# Altium schematic sheet DAC.SchDoc: DAC
size 420 x 297 mm; Date: March 14; CheckedBy: ThS. Bùi Quốc Bảo; DrawnBy: Nguyễn Gia Huy; Revision: V1.0; SheetNumber: 10; SheetTotal: 11; MasterProject: STM32-PLC; Sub-system: DA1_prj.PrjPcb
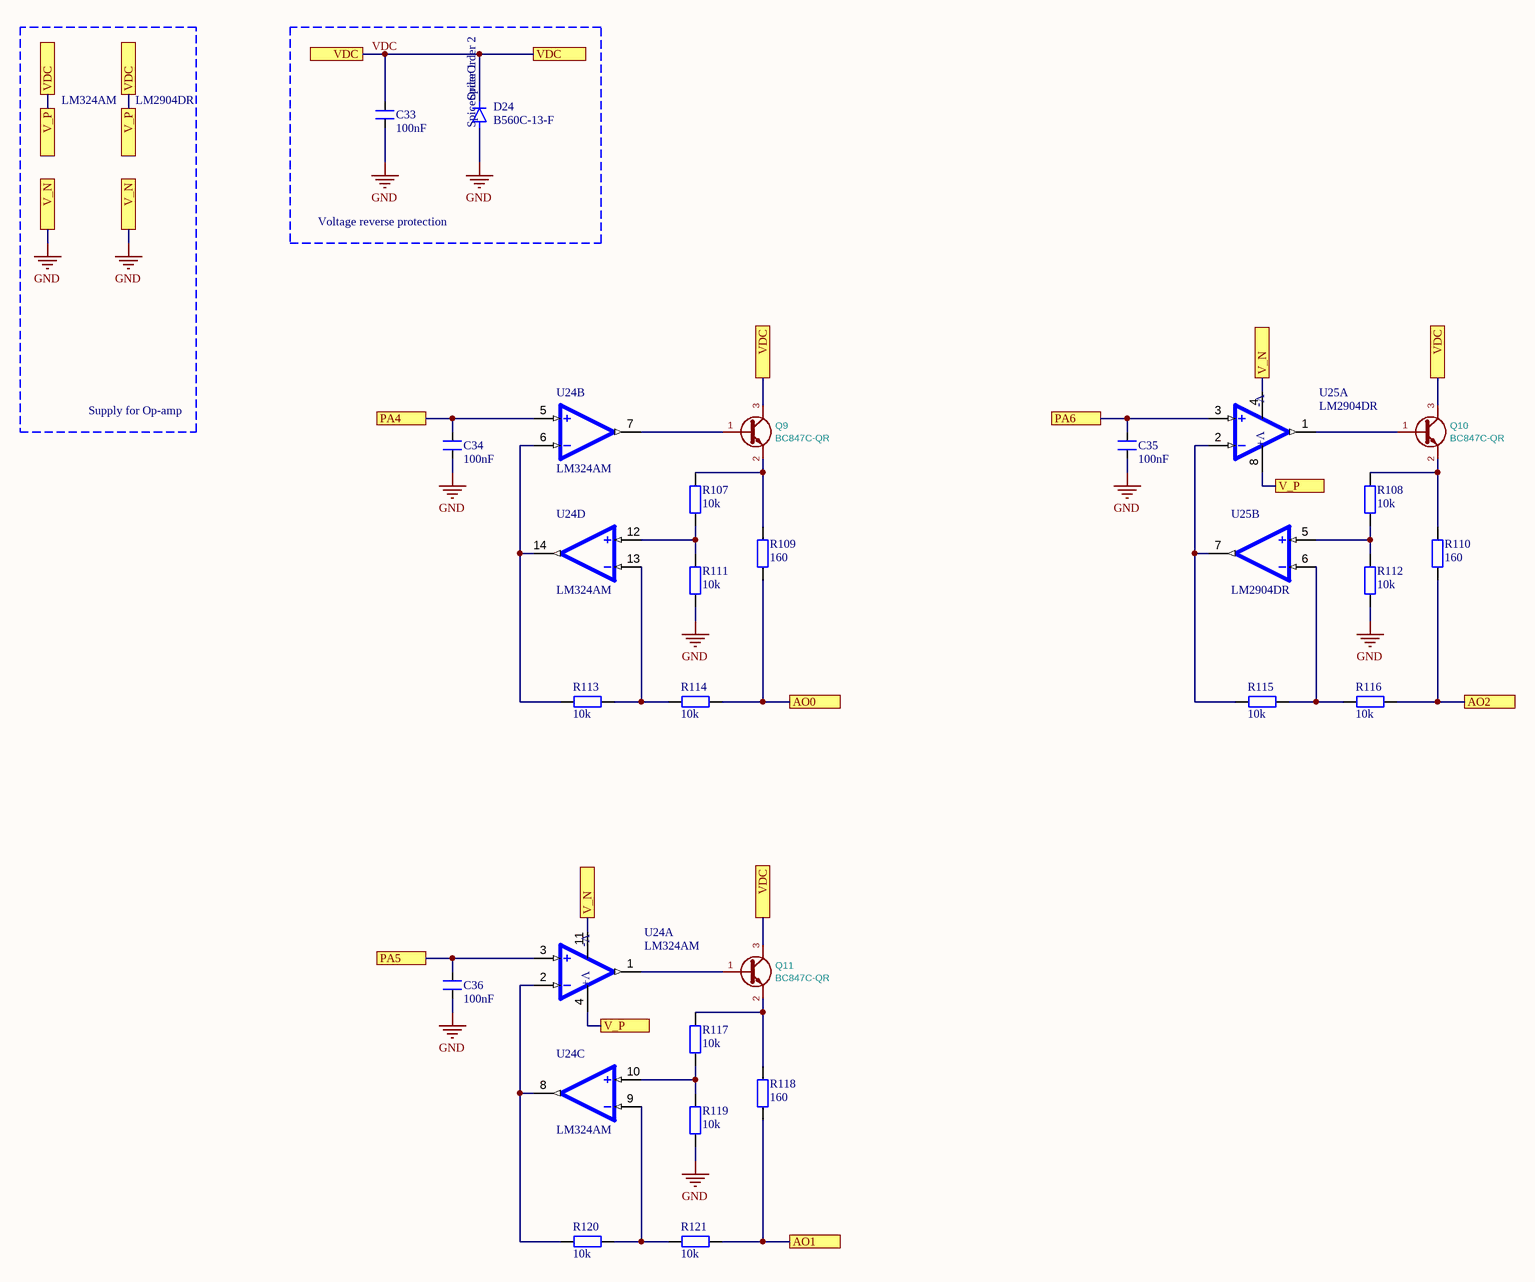
[diagram p0: DAC.SchDoc]

## Parts
C33  100nF  [FP-C0603C-CF-IPC_A]
C34  100nF  [FP-C0603C-CF-IPC_A]
C35  100nF  [FP-C0603C-CF-IPC_A]
C36  100nF  [FP-C0603C-CF-IPC_A]
D24  B560C-13-F  [SMC]
Q9  BC847C-QR  [SOT95P240X111-3N]
Q10  BC847C-QR  [SOT95P240X111-3N]
Q11  BC847C-QR  [SOT95P240X111-3N]
R107  10k  [tro smd 0603]
R108  10k  [tro smd 0603]
R109  160  [tro smd 0603]
R110  160  [tro smd 0603]
R111  10k  [tro smd 0603]
R112  10k  [tro smd 0603]
R113  10k  [tro smd 0603]
R114  10k  [tro smd 0603]
R115  10k  [tro smd 0603]
R116  10k  [tro smd 0603]
R117  10k  [tro smd 0603]
R118  160  [tro smd 0603]
R119  10k  [tro smd 0603]
R120  10k  [tro smd 0603]
R121  10k  [tro smd 0603]
U24  LM324AM  [SOIC127P600X175-14N]  (parts A,B,C,D of 4)
U25  LM2904DR  [SOIC127P599X175-8N]  (parts A,B of 2)

## Blocks framed on the sheet
Voltage reverse protection: C33 D24

## Ports
AO0 (see STM32_PLC[4C]), AO1 (see STM32_PLC[4C]), AO2 (see STM32_PLC[4C]), PA4 (see STM32_PLC[1B], STM32_PLC[4C]), PA5 (see STM32_PLC[1B], STM32_PLC[4C]), PA6 (see STM32_PLC[1B], STM32_PLC[4C]), V_N (see DAC[1A], DAC[2C]), V_N (see DAC[1A], DAC[2C], DAC[4B]), V_N (see DAC[1A], DAC[4B]), V_P (see DAC[1A], DAC[2C]), V_P (see DAC[1A], DAC[2C], DAC[4B]), V_P (see DAC[1A], DAC[4B]), VDC (see DAC[1A], DAC[2A], DAC[3B], DAC[3C], DAC[5B], STM32_PLC[4C]), VDC (see DAC[1A], DAC[2A], DAC[3B], DAC[3C], STM32_PLC[4C]), VDC (see DAC[1A], DAC[2A], DAC[3B], DAC[5B], STM32_PLC[4C]), VDC (see DAC[1A], DAC[2A], DAC[3C], DAC[5B], STM32_PLC[4C])

## Nets
GND: C33.2 C34.2 C35.2 C36.2 D24.A R111.1 R112.1 R119.1 U24.11(GND) U25.4(V-) ; port V_N
AO0: R109.1 R114.1 ; port AO0
AO1: R118.1 R121.1 ; port AO1
AO2: R110.1 R116.1 ; port AO2
PA4: C34.1 U24.5(IN2+) ; port PA4
PA5: C36.1 U24.3(IN1+) ; port PA5
PA6: C35.1 U25.3(IN1+) ; port PA6
VDC: C33.1 D24.C Q9.3(C) Q10.3(C) Q11.3(C) U24.4(V+) U25.8(V+) ; port VDC, port V_P
NetQ9_1: Q9.1(B) U24.7(OUT2)
NetQ9_2: Q9.2(E) R107.2 R109.2
NetQ10_1: Q10.1(B) U25.1(OUT1)
NetQ10_2: Q10.2(E) R108.2 R110.2
NetQ11_1: Q11.1(B) U24.1(OUT1)
NetQ11_2: Q11.2(E) R117.2 R118.2
NetR107_1: R107.1 R111.2 U24.12(IN4+)
NetR108_1: R108.1 R112.2 U25.5(IN2+)
NetR113_1: R113.1 R114.2 U24.13(IN4-)
NetR113_2: R113.2 U24.6(IN2-) U24.14(OUT4)
NetR115_1: R115.1 R116.2 U25.6(IN2-)
NetR115_2: R115.2 U25.2(IN1-) U25.7(OUT2)
NetR117_1: R117.1 R119.2 U24.10(IN3+)
NetR120_1: R120.1 R121.2 U24.9(IN3-)
NetR120_2: R120.2 U24.2(IN1-) U24.8(OUT3)

## Notes on the sheet
- LM324AM
- LM2904DR
- Supply for Op-amp
- Sub-system:
- Project:
- Design by:
- Sheet title:
- Sheet
- of
- Checked by:
- Approved by:
- Doc No:
- Revision:
- Size:
- Dates:
- A3
- (in symbol B560C-13-F) SpiceOrder 2; SpiceOrder 1
- (in symbol LM324AM/NOPB, part A) V-

## Library data of the parts
C33-C36 = CN-SEMI-DIP: Capacitor (Semiconductor SIM Model); Value: 104; LatestRevisionDate: 17-Jul-2002; LatestRevisionNote: Re-released for DXP Platform.; PackageReference: C1206; Publisher: Altium Limited
D24 = B560C-13-F: Diode Schottky 60 V 5A Surface Mount SMC; MF: Diodes Inc.; SnapEDA_Link: https://www.snapeda.com/parts/B560C-13-F/Diodes+Inc./view-part/?ref=snap; Package: SMC-2 Diodes; Value: *; MP: B560C-13-F; Check_prices: https://www.snapeda.com/parts/B560C-13-F/Diodes+Inc./view-part/?ref=eda
Q9-Q11 = BC847: LCSC: C2145; Value: BC847C-QR; Footprint: Package_TO_SOT_SMD:SOT-23
R107-R121 = Tro 0603 1% 10k: RES; Chung_Loai: Dán; Don_Vi: Con; So_Chan: 2; Ten_Linh_Kien: Trở 0603 1% 10k; Ma_Hang: MH006333; Kieu_Chan: *
U24 = LM324AM/NOPB: Low power general-purpose quad operational amplifier 14-SOIC 0 to 70; MF: Texas Instruments; SnapEDA_Link: https://www.snapeda.com/parts/LM324AM/Texas+Instruments/view-part/?ref=snap; Package: SOIC-14 Texas Instruments; Value: *; MP: LM324AM; Check_prices: https://www.snapeda.com/parts/LM324AM/Texas+Instruments/view-part/?ref=eda
U25 = LM2904DR: Dual, 26-V, 700-kHz operational amplifier; MF: Texas Instruments; SnapEDA_Link: https://www.snapeda.com/parts/LM2904DR/Texas+Instruments/view-part/?ref=snap; Package: SOIC-8 Texas Instruments; Value: *; MP: LM2904DR; Check_prices: https://www.snapeda.com/parts/LM2904DR/Texas+Instruments/view-part/?ref=eda